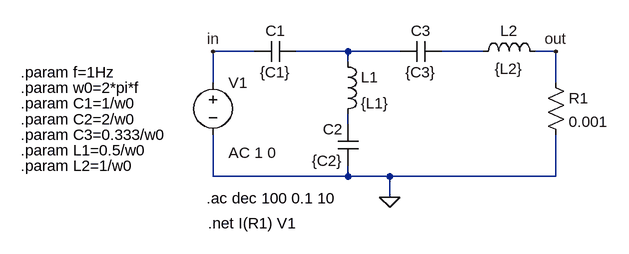
[diagram p0: schematic TS11_1.asc]
TS11_1.asc, the LTspice schematic file:
Version 4
SHEET 1 880 680
WIRE -32 32 -96 32
WIRE 112 32 32 32
WIRE 192 32 112 32
WIRE 320 32 256 32
WIRE 432 32 400 32
WIRE 112 48 112 32
WIRE -96 80 -96 32
WIRE 432 80 432 32
WIRE 112 144 112 128
WIRE -96 224 -96 160
WIRE 112 224 112 208
WIRE 112 224 -96 224
WIRE 176 224 112 224
WIRE 432 224 432 160
WIRE 432 224 176 224
WIRE 176 256 176 224
FLAG 176 256 0
FLAG 432 32 out
FLAG -96 32 in
SYMBOL cap 32 16 R90
WINDOW 0 0 32 VBottom 2
WINDOW 3 32 32 VTop 2
SYMATTR InstName C1
SYMATTR Value {C1}
SYMBOL cap 128 208 R180
WINDOW 0 24 56 Left 2
WINDOW 3 24 8 Left 2
SYMATTR InstName C2
SYMATTR Value {C2}
SYMBOL cap 192 48 R270
WINDOW 0 32 32 VTop 2
WINDOW 3 0 32 VBottom 2
SYMATTR InstName C3
SYMATTR Value {C3}
SYMBOL ind 96 32 R0
SYMATTR InstName L1
SYMATTR Value {L1}
SYMBOL ind 304 48 R270
WINDOW 0 32 56 VTop 2
WINDOW 3 5 56 VBottom 2
SYMATTR InstName L2
SYMATTR Value {L2}
SYMBOL voltage -96 64 R0
WINDOW 123 24 124 Left 2
WINDOW 39 0 0 Left 0
SYMATTR InstName V1
SYMATTR Value ""
SYMATTR Value2 AC 1 0
SYMBOL res 416 64 R0
SYMATTR InstName R1
SYMATTR Value 0.001
TEXT -106 258 Left 2 !.ac dec 100 0.1 10
TEXT -104 296 Left 2 !.net I(R1) V1
TEXT -392 64 Left 2 !.param f=1Hz
TEXT -392 88 Left 2 !.param w0=2*pi*f
TEXT -392 112 Left 2 !.param C1=1/w0
TEXT -392 136 Left 2 !.param C2=2/w0
TEXT -392 160 Left 2 !.param C3=0.333/w0
TEXT -392 184 Left 2 !.param L1=0.5/w0
TEXT -392 208 Left 2 !.param L2=1/w0

The netlist it stands for:
* TS11_1.asc
C1 N001 in {C1}
C2 0 N003 {C2}
C3 N001 N002 {C3}
L1 N001 N003 {L1}
L2 N002 out {L2}
V1 in 0 AC 1 0
R1 out 0 0.001
.ac dec 100 0.1 10
.net I(R1) V1
.param f=1Hz
.param w0=2*pi*f
.param C1=1/w0
.param C2=2/w0
.param C3=0.333/w0
.param L1=0.5/w0
.param L2=1/w0
.backanno
.end